# EAGLE schematic Microcontroller_Microchip_dsPIC33EP256MU806 (EAGLE 6.1)
Microcontroller dsPIC33EP256MU806 <http://www.microchip.com/wwwproducts/Devices.aspx?dDocName=en557404> This sheet contains the microcontroller with programming pins, oscillator, and all required capacitors. An optional battery voltage sensor is included. Safe up to 20V. PGED net must be connected to PGED1, PGED2, or PGED3 pins on the microcontorller. PGEC net must be connected to PGEC1, PGEDC, or PGEC3 pins on the microcontorller. Fin = 10mhz; PLLDIV = 54; PLLPRE = 0; PLLPOST = 0; Fosc = 140mhz; Ffcy = 70mhz
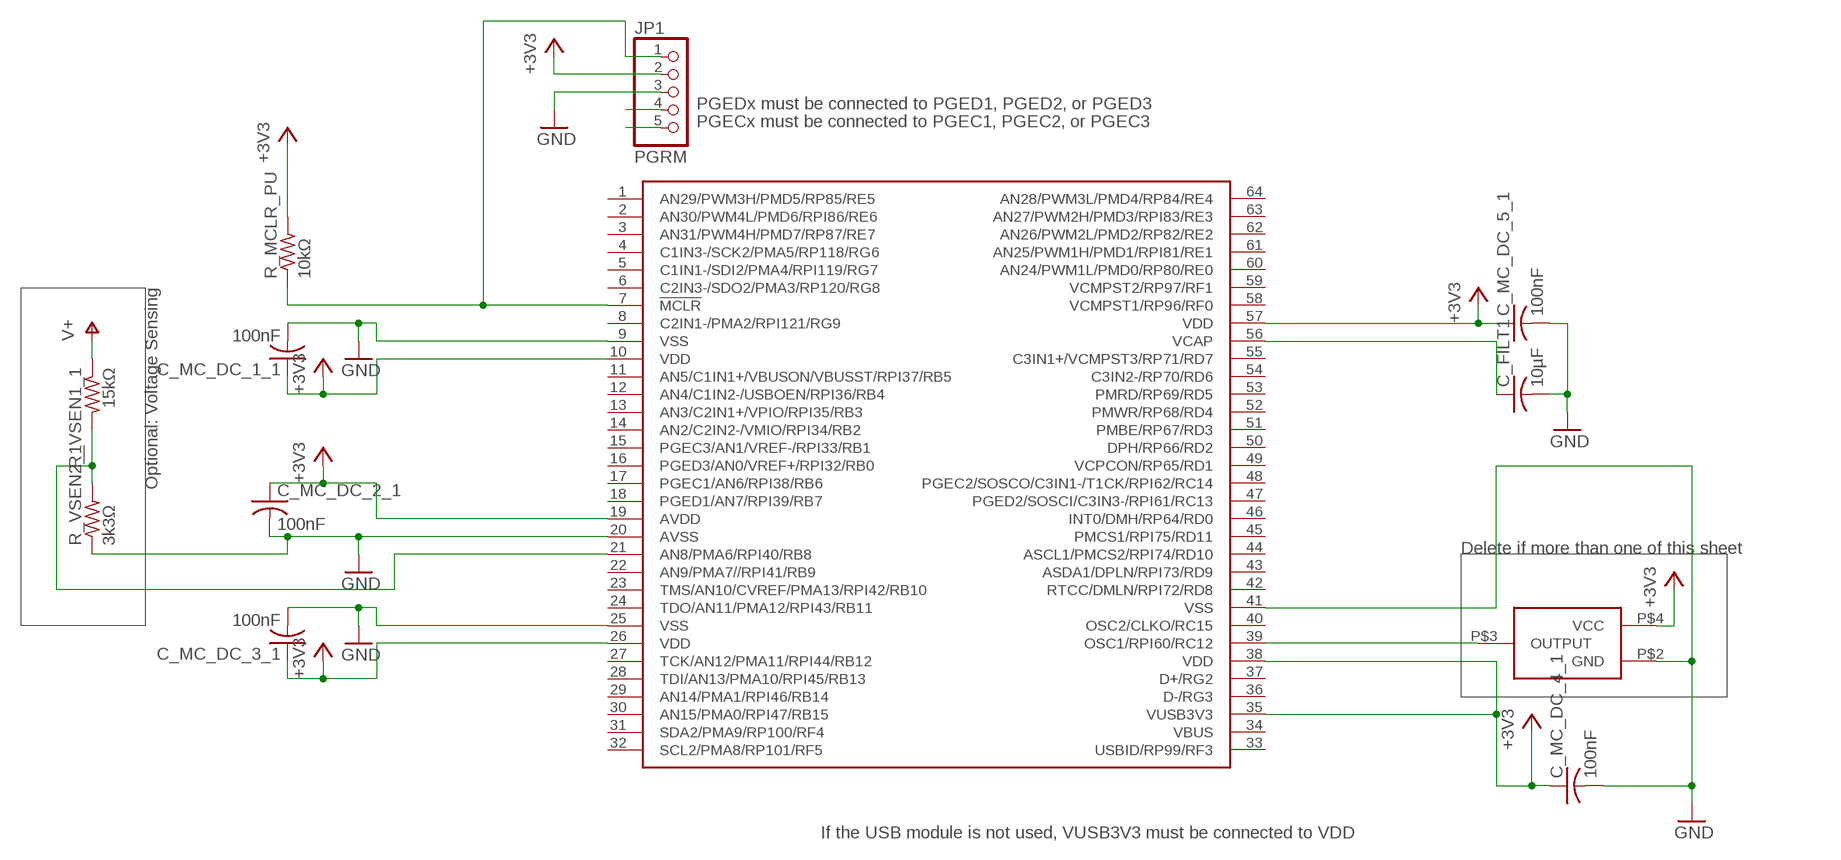
[diagram p0: schematic, sheet 1]

## Parts
C_FILT1  10µF  C-USC0805  [C0805]
C_MC_DC_1_1  100nF  C-USC0603  [C0603]
C_MC_DC_2_1  100nF  C-USC0603  [C0603]
C_MC_DC_3_1  100nF  C-USC0603  [C0603]
C_MC_DC_4_1  100nF  C-USC0603  [C0603]
C_MC_DC_5_1  100nF  C-USC0603  [C0603]
JP1  PGRM  PINHD-1X05_2.00  [1X05M]
MC1  DSPIC33EP256MU806-I/PT  [S-PQFP-G64]
OSC1  FOX924B  [4-SMD_5X3.2]
R_MCLR_PU  10kΩ  R-US_R0603  [R0603]
R_VSEN1_1  15kΩ  R-US_R0603  [R0603]
R_VSEN2_1  3k3Ω  R-US_R0603  [R0603]

## Nets
16MHZ_3V3: MC1.39(OSC1/RPI60/RC12) OSC1.P$3(OUTPUT)
!MCLR!1: JP1.1 MC1.7(!MCLR!) R_MCLR_PU.1
+3V3: C_MC_DC_1_1.1 C_MC_DC_2_1.1 C_MC_DC_3_1.1 C_MC_DC_4_1.1 C_MC_DC_5_1.1 JP1.2 MC1.10(VDD) MC1.19(AVDD) MC1.26(VDD) MC1.35(VUSB3V3) MC1.38(VDD) MC1.57(VDD) OSC1.P$4(VCC) R_MCLR_PU.2
GND: C_FILT1.2 C_MC_DC_1_1.2 C_MC_DC_2_1.2 C_MC_DC_3_1.2 C_MC_DC_4_1.2 C_MC_DC_5_1.2 JP1.3 MC1.9(VSS) MC1.20(AVSS) MC1.25(VSS) MC1.41(VSS) OSC1.P$2(GND) R_VSEN2_1.1
PGEC1: JP1.5
PGED1: JP1.4
V+: R_VSEN1_1.1
V_SENSE1: MC1.21(AN8/PMA6/RPI40/RB8) R_VSEN1_1.2 R_VSEN2_1.2
VCAP1: C_FILT1.1 MC1.56(VCAP)
Unconnected: MC1.1(AN29/PWM3H/PMD5/RP85/RE5) MC1.2(AN30/PWM4L/PMD6/RPI86/RE6) MC1.3(AN31/PWM4H/PMD7/RP87/RE7) MC1.4(C1IN3-/SCK2/PMA5/RP118/RG6) MC1.5(C1IN1-/SDI2/PMA4/RPI119/RG7) MC1.6(C2IN3-/SDO2/PMA3/RP120/RG8) MC1.8(C2IN1-/PMA2/RPI121/RG9) MC1.11(AN5/C1IN1+/VBUSON/VBUSST/RPI37/RB5) MC1.12(AN4/C1IN2-/USBOEN/RPI36/RB4) MC1.13(AN3/C2IN1+/VPIO/RPI35/RB3) MC1.14(AN2/C2IN2-/VMIO/RPI34/RB2) MC1.15(PGEC3/AN1/VREF-/RPI33/RB1) MC1.16(PGED3/AN0/VREF+/RPI32/RB0) MC1.17(PGEC1/AN6/RPI38/RB6) MC1.18(PGED1/AN7/RPI39/RB7) MC1.22(AN9/PMA7//RPI41/RB9) MC1.23(TMS/AN10/CVREF/PMA13/RPI42/RB10) MC1.24(TDO/AN11/PMA12/RPI43/RB11) MC1.27(TCK/AN12/PMA11/RPI44/RB12) MC1.28(TDI/AN13/PMA10/RPI45/RB13) MC1.29(AN14/PMA1/RPI46/RB14) MC1.30(AN15/PMA0/RPI47/RB15) MC1.31(SDA2/PMA9/RP100/RF4) MC1.32(SCL2/PMA8/RP101/RF5) MC1.33(USBID/RP99/RF3) MC1.34(VBUS) MC1.36(D-/RG3) MC1.37(D+/RG2) MC1.40(OSC2/CLKO/RC15) MC1.42(RTCC/DMLN/RPI72/RD8) MC1.43(ASDA1/DPLN/RPI73/RD9) MC1.44(ASCL1/PMCS2/RPI74/RD10) MC1.45(PMCS1/RPI75/RD11) MC1.46(INT0/DMH/RP64/RD0) MC1.47(PGED2/SOSCI/C3IN3-/RPI61/RC13) MC1.48(PGEC2/SOSCO/C3IN1-/T1CK/RPI62/RC14) MC1.49(VCPCON/RP65/RD1) MC1.50(DPH/RP66/RD2) MC1.51(PMBE/RP67/RD3) MC1.52(PMWR/RP68/RD4) MC1.53(PMRD/RP69/RD5) MC1.54(C3IN2-/RP70/RD6) MC1.55(C3IN1+/VCMPST3/RP71/RD7) MC1.58(VCMPST1/RP96/RF0) MC1.59(VCMPST2/RP97/RF1) MC1.60(AN24/PWM1L/PMD0/RP80/RE0) MC1.61(AN25/PWM1H/PMD1/RPI81/RE1) MC1.62(AN26/PWM2L/PMD2/RP82/RE2) MC1.63(AN27/PWM2H/PMD3/RPI83/RE3) MC1.64(AN28/PWM3L/PMD4/RP84/RE4)

## Notes on the sheet
- PGEDx must be connected to PGED1, PGED2, or PGED3
- PGECx must be connected to PGEC1, PGEC2, or PGEC3
- Optional: Voltage Sensing
- Delete if more than one of this sheet
- If the USB module is not used, VUSB3V3 must be connected to VDD

## Library data of the parts
C_FILT1 C_MC_DC_1_1 C_MC_DC_2_1 C_MC_DC_3_1 C_MC_DC_4_1 C_MC_DC_5_1 = resistor:C-US: CAPACITOR, American symbol
JP1 = pinhead-2:PINHD-1X05: PIN HEADER
MC1 = piccoli:DSPIC33EP256MU806-I/PT
OSC1 = piccoli:FOX924B
R_MCLR_PU R_VSEN1_1 R_VSEN2_1 = resistor:R-US_: RESISTOR, American symbol

## Net classes
4 xxwide: width 0.203 mm